# EAGLE design lorentz_debye_fr4 (EAGLE 7.6.0)
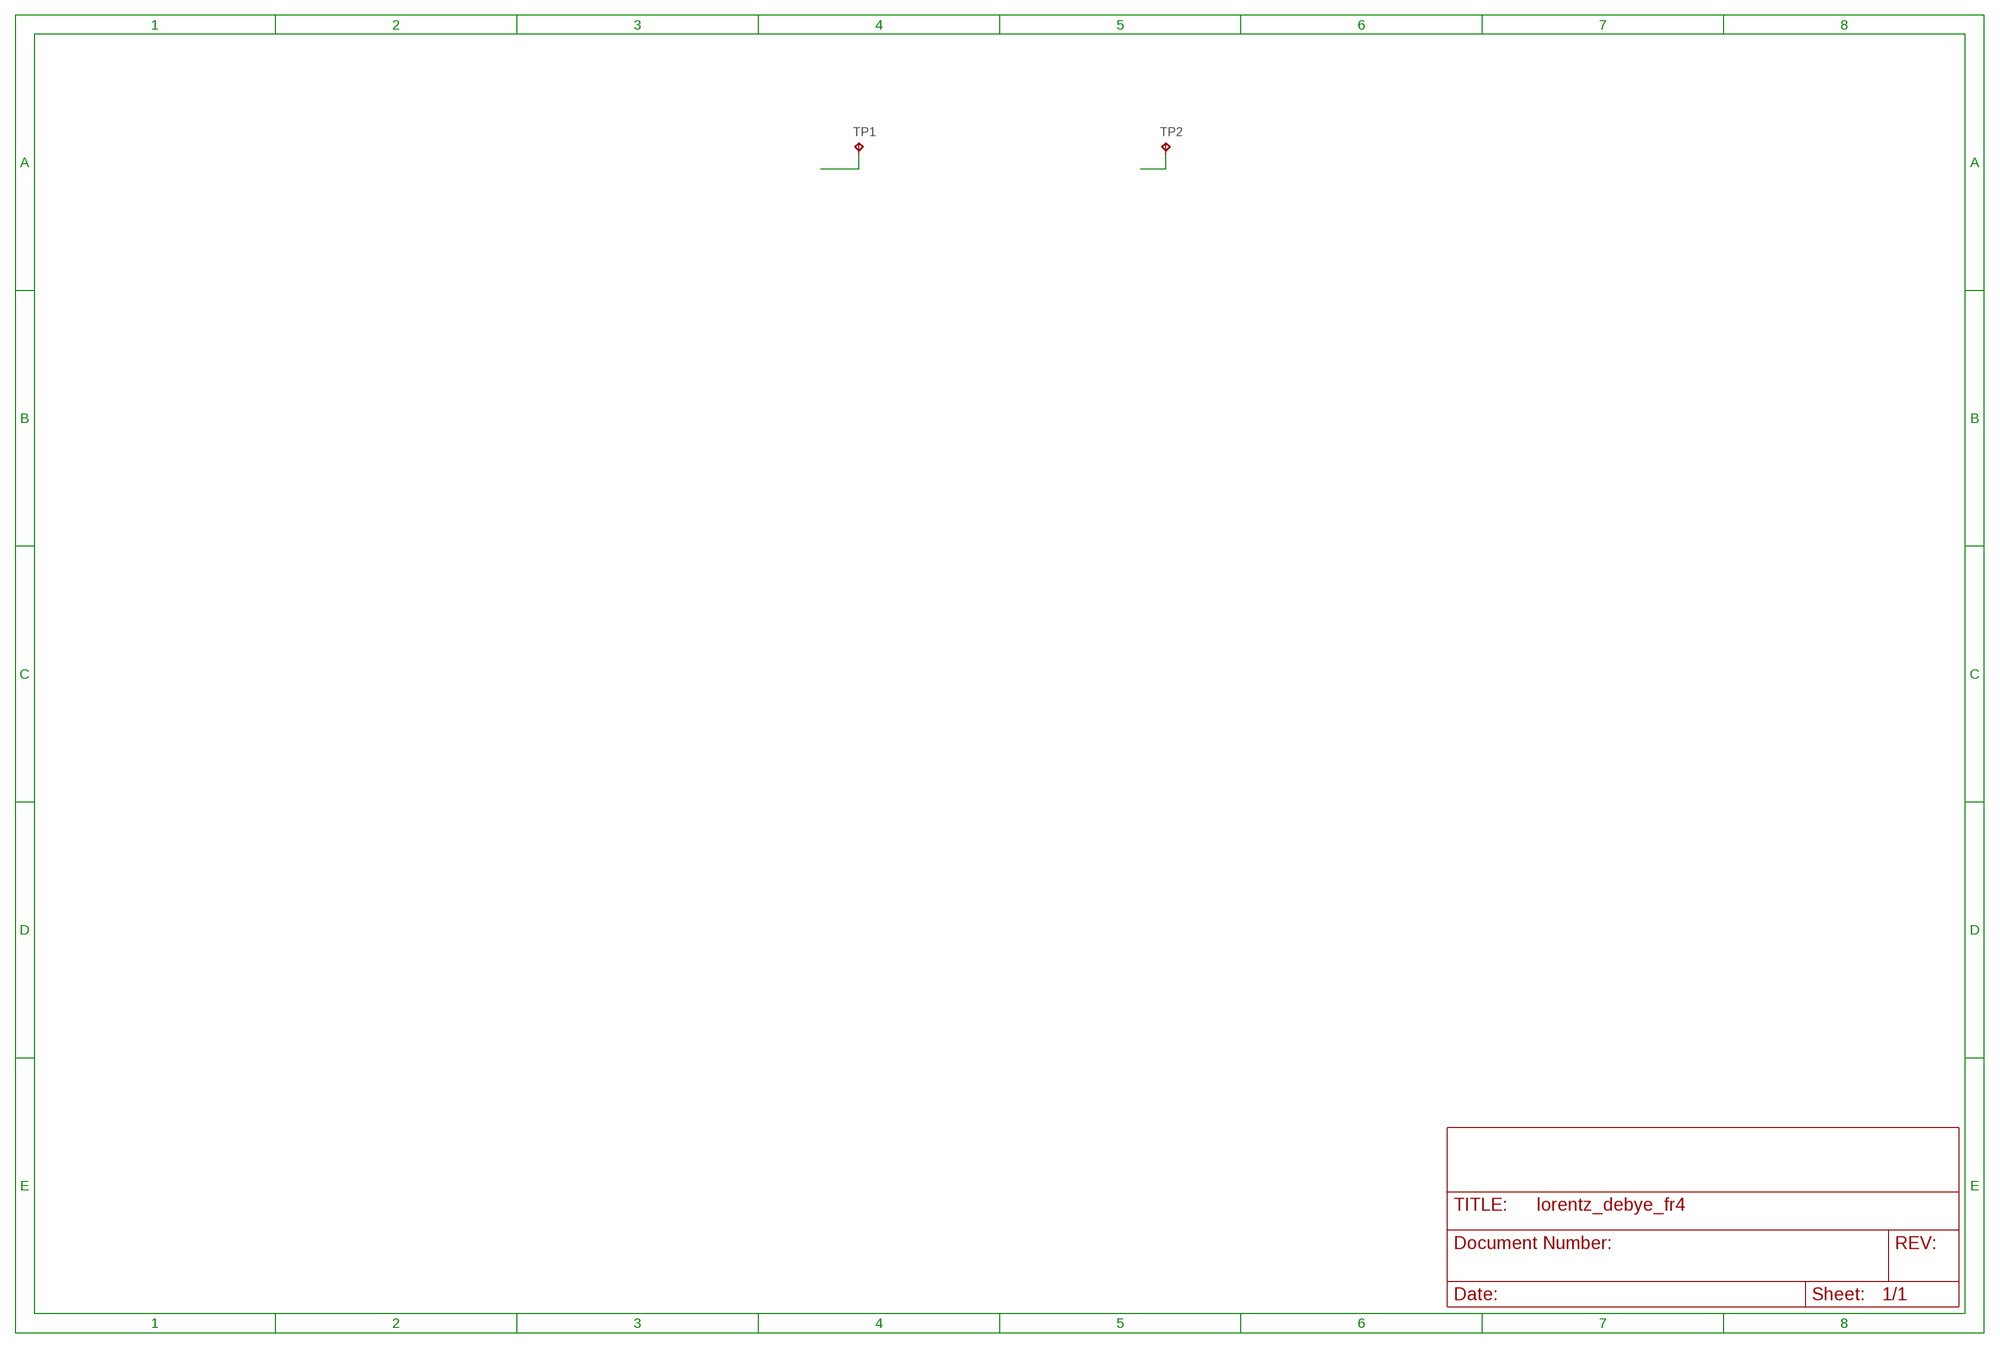
[diagram p0: schematic, sheet 1]

## Parts
TP1  TPTP06SQ  [TP06SQ]
TP2  TPTP06SQ  [TP06SQ]

## Nets
GND: TP1.TP TP2.TP

## Library data of the parts
TP1 TP2 = testpad:TP: Test pad

## Board
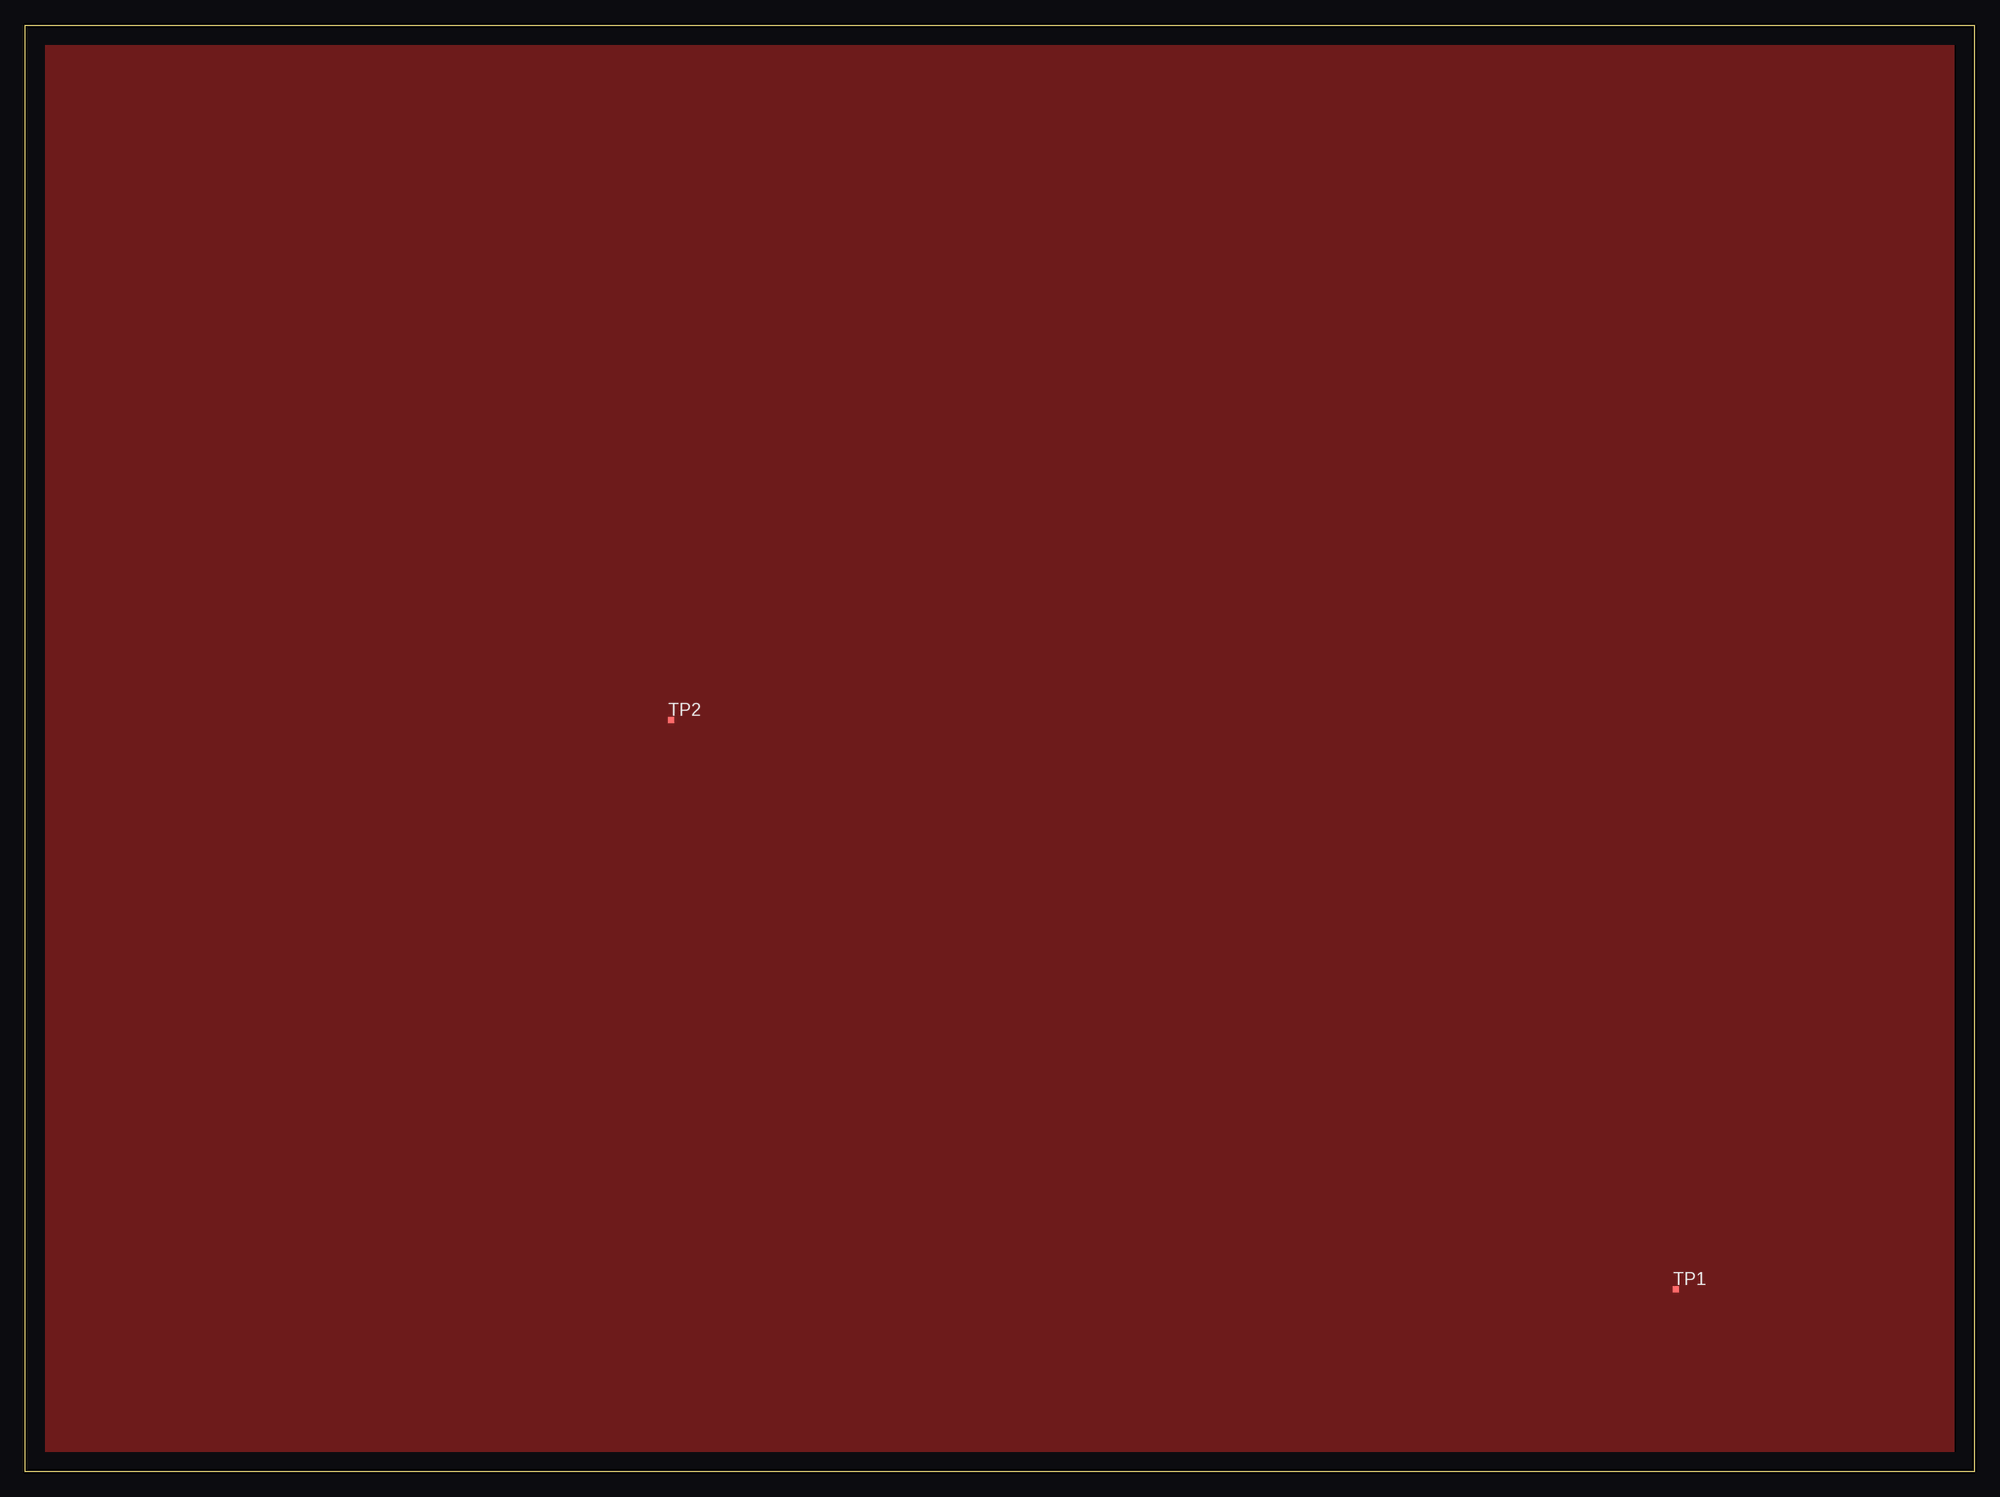
[diagram p1: board, top side]
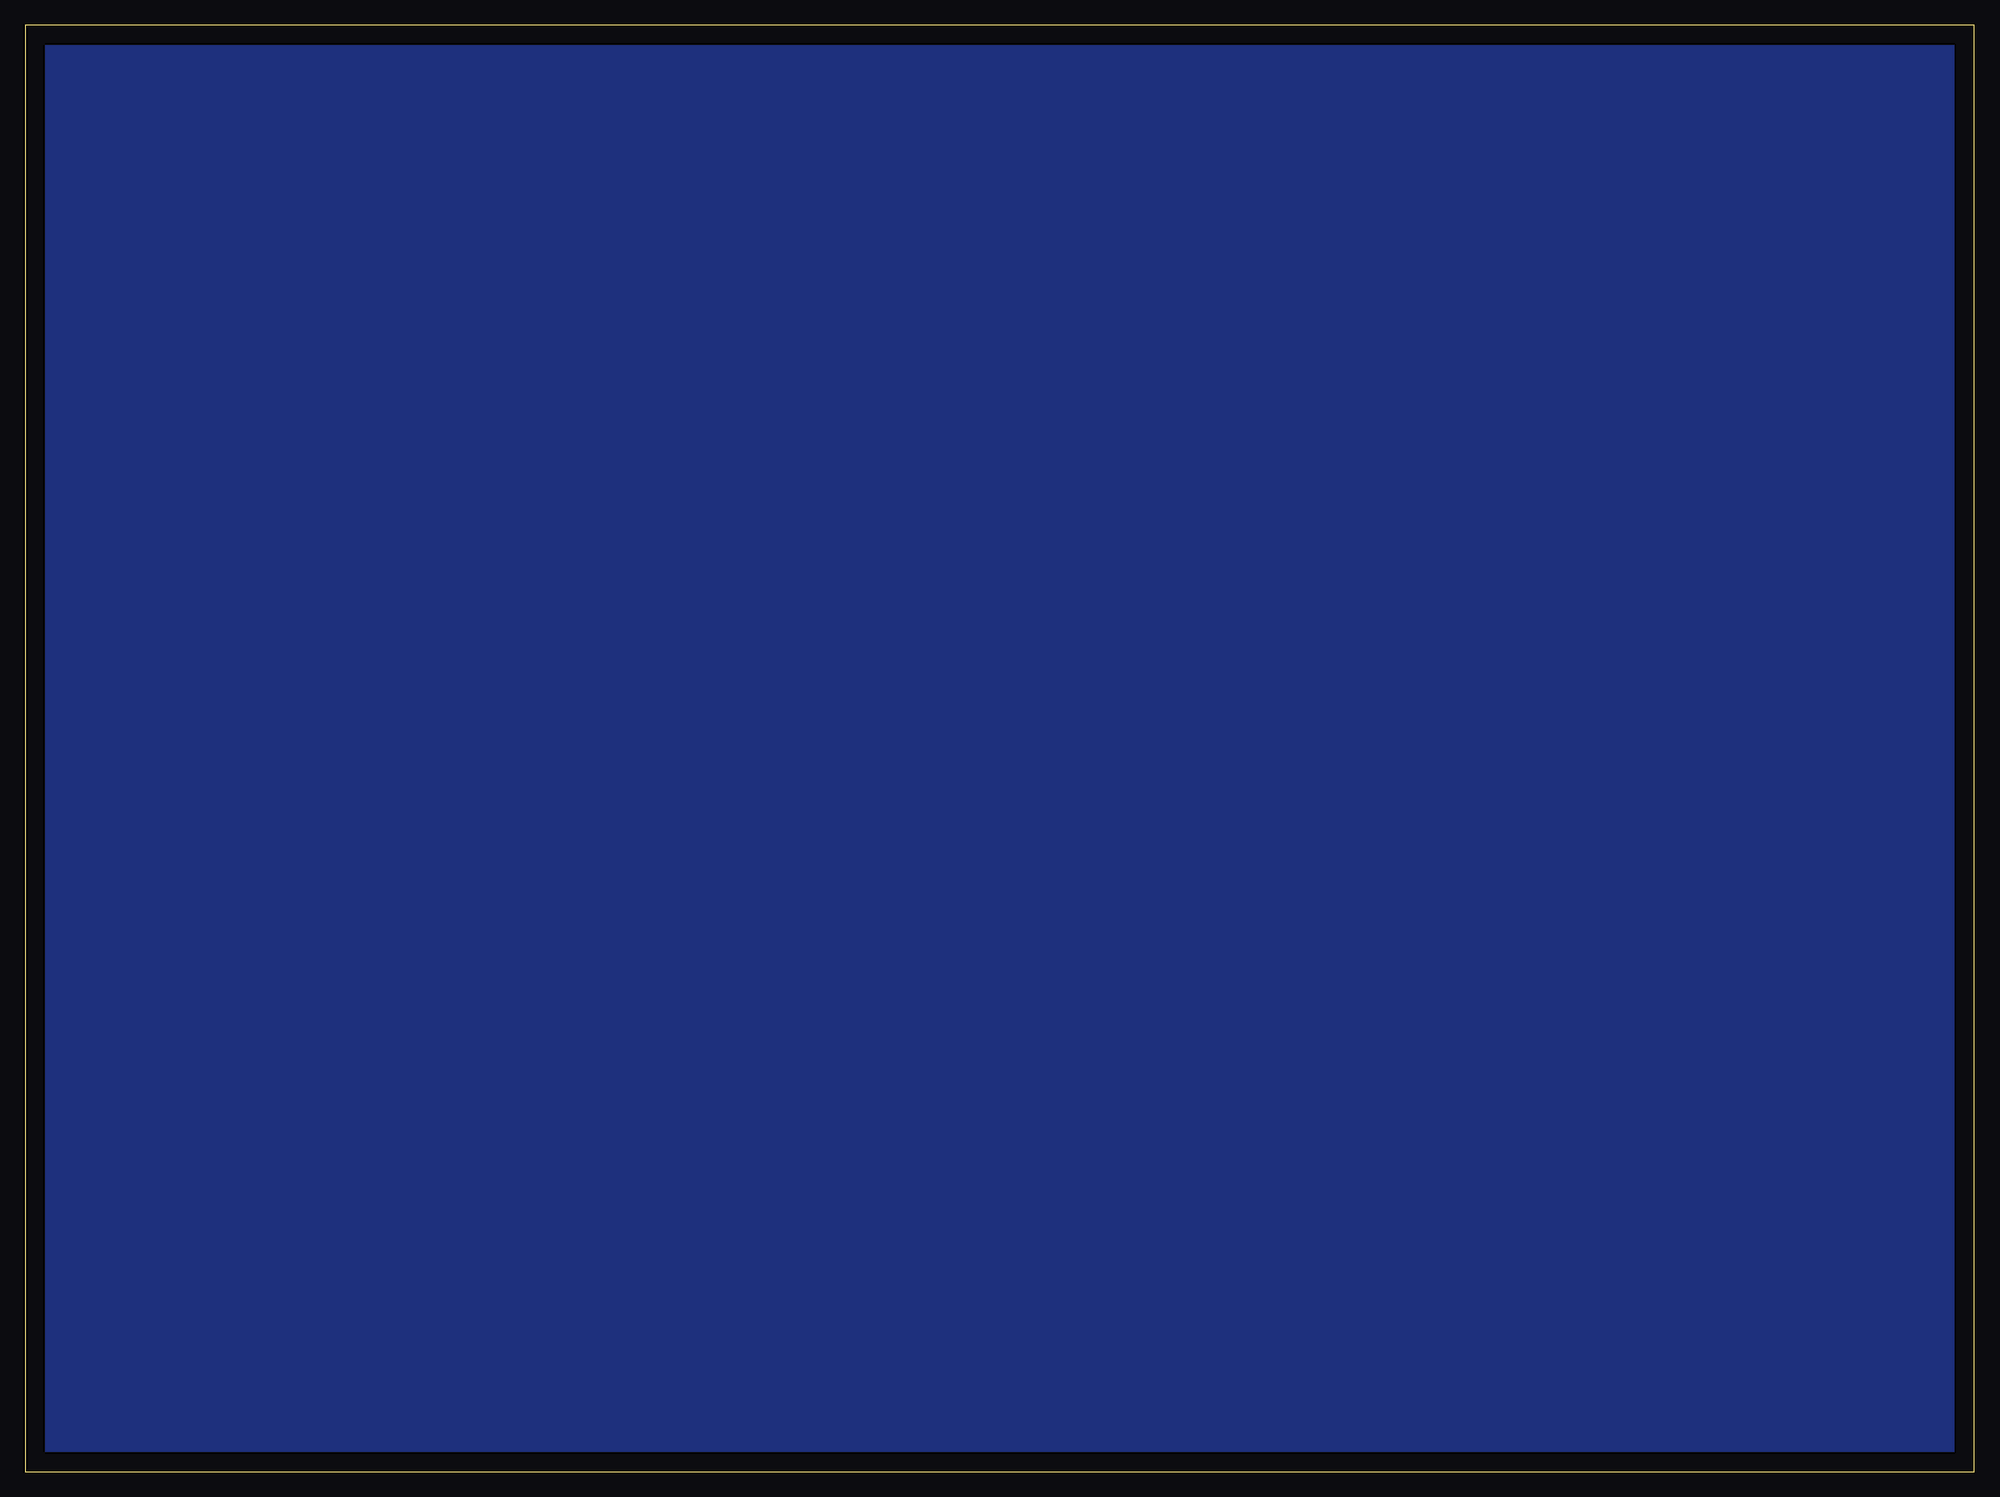
[diagram p2: board, bottom side, seen from below]

Size 194 x 144 mm. Coordinates in mm from the lower left corner, seen from the top.
Outline: 0,0 0,144 194,144 194,0 0,0
Copper layers (1*16): Top 0.07mm / dielectric 1.65mm / Bottom 0.07mm
Design rules "default *": minimum track width 10mil, minimum drill 24mil, track to track 8mil, track to pad 8mil, pad to pad 8mil, via to via 8mil, smd to smd 8mil, copper to edge 0mil, drill to drill 8mil, minimum pad ring 10mil, minimum via ring 8mil, stop-mask expansion 0mil, vias tented up to drill 0mil, thermal gap 10mil

### Footprints (pad centres in the part's own frame; a part is rotated, then mirrored left to right if it is on the bottom)
TP06SQ = smd 0.6 x 0.6: TP 0,0

### Placement (x,y rotation side)
TP1  164.3,18.17 0 top
TP2  64.29,74.82 0 top

### Tracks (layer width: path | path; a pad name or v marks a point on that pad's centre or on a via)
GND
  pour Bottom (no thermals): 2,142 2,2 192,2 192,142
  pour Top (no thermals): 2,142 2,2 192,2 192,142